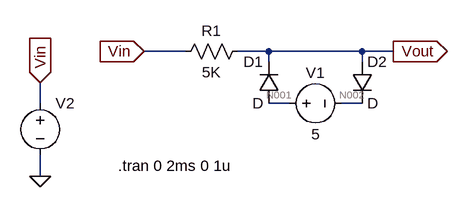
[diagram p0: schematic HW 6 #1a - Overall.asc]
HW 6 #1a - Overall.asc, the LTspice schematic file:
Version 4
SHEET 1 880 680
WIRE 80 144 16 144
WIRE 208 144 160 144
WIRE 352 144 208 144
WIRE 400 144 352 144
WIRE 208 160 208 144
WIRE 352 160 352 144
WIRE -144 224 -144 192
WIRE 240 224 208 224
WIRE 352 224 320 224
WIRE -144 336 -144 304
FLAG 16 144 Vin
IOPIN 16 144 In
FLAG 400 144 Vout
IOPIN 400 144 Out
FLAG -144 192 Vin
IOPIN -144 192 In
FLAG -144 336 0
SYMBOL res 176 128 R90
WINDOW 0 0 56 VBottom 2
WINDOW 3 32 56 VTop 2
SYMATTR InstName R1
SYMATTR Value 5K
SYMBOL voltage 224 224 R270
WINDOW 0 32 56 VTop 2
WINDOW 3 -32 56 VBottom 2
SYMATTR InstName V1
SYMATTR Value 5
SYMBOL voltage -144 208 R0
SYMATTR InstName V2
SYMATTR Value ""
SYMBOL diode 224 224 R180
WINDOW 0 24 64 Left 2
WINDOW 3 24 0 Left 2
SYMATTR InstName D1
SYMBOL diode 336 160 R0
SYMATTR InstName D2
TEXT -24 320 Left 2 !.tran 0 2ms 0 1u

The netlist it stands for:
* HW 6 #1a - Overall.asc
R1 Vout Vin 5K
V1 N001 N002 5
V2 Vin 0
D1 N001 Vout D
D2 Vout N002 D
.model D D
.lib standard.dio
.tran 0 2ms 0 1u
.backanno
.end

* Results of the author's LTspice run, read from the files saved beside the schematic
* Operating Point, zero values left out:
*   V(n001) = 2.5 V
*   V(n002) = -2.5 V
*   I(D1) = 1.072 TA
*   I(D2) = 1.072 TA
*   I(V1) = -1.072 TA